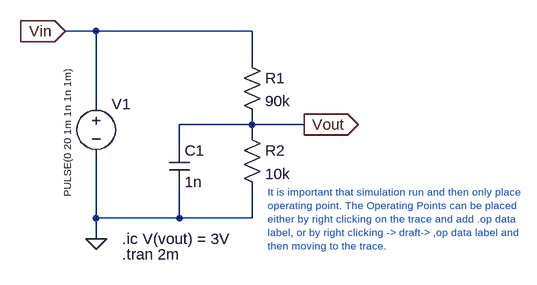
[diagram p0: schematic DC Op in Transient Simulation.asc]
DC Op in Transient Simulation.asc, the LTspice schematic file:
Version 4
SHEET 1 956 680
WIRE 112 96 64 96
WIRE 352 96 112 96
WIRE 352 144 352 96
WIRE 112 208 112 96
WIRE 352 240 352 224
WIRE 352 240 240 240
WIRE 432 240 352 240
WIRE 352 256 352 240
WIRE 240 272 240 240
WIRE 112 384 112 288
WIRE 240 384 240 336
WIRE 240 384 112 384
WIRE 352 384 352 336
WIRE 352 384 240 384
WIRE 112 416 112 384
FLAG 112 416 0
FLAG 432 240 Vout
IOPIN 432 240 Out
FLAG 64 96 Vin
IOPIN 64 96 In
DATAFLAG 240 96 ""
DATAFLAG 400 240 ""
DATAFLAG 240 240 ""
SYMBOL voltage 112 192 R0
WINDOW 3 -44 -34 VRight 1
WINDOW 123 0 0 Left 0
WINDOW 39 0 0 Left 0
SYMATTR Value PULSE(0 20 1m 1n 1n 1m)
SYMATTR InstName V1
SYMBOL res 336 128 R0
SYMATTR InstName R1
SYMATTR Value 90k
SYMBOL res 336 240 R0
SYMATTR InstName R2
SYMATTR Value 10k
SYMBOL cap 224 272 R0
SYMATTR InstName C1
SYMATTR Value 1n
TEXT 152 440 Left 2 !.tran 2m
TEXT 152 416 Left 2 !.ic V(vout) = 3V
TEXT 376 344 Left 1 ;It is important that simulation run and then only place \noperating point. The Operating Points can be placed\neither by right clicking on the trace and add .op data\nlabel, or by right clicking -> draft-> ,op data label and\nthen moving to the trace.

The netlist it stands for:
* DC Op in Transient Simulation.asc
V1 Vin 0 PULSE(0 20 1m 1n 1n 1m)
R1 Vin Vout 90k
R2 Vout 0 10k
C1 Vout 0 1n
.tran 2m
.ic V(vout) = 3V
* It is important that simulation run and then only place
* operating point. The Operating Points can be placed
* either by right clicking on the trace and add .op data
* label, or by right clicking -> draft-> ,op data label and
* then moving to the trace.
.backanno
.end